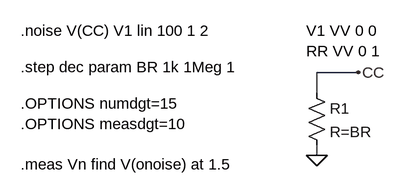
[diagram p0: schematic Fig_3-16_BR-noise.asc]
Fig_3-16_BR-noise.asc, the LTspice schematic file:
Version 4
SHEET 1 880 680
WIRE 368 112 304 112
WIRE 304 144 304 112
WIRE 304 240 304 224
FLAG 304 240 0
FLAG 368 112 CC
SYMBOL res 288 128 R0
SYMATTR InstName R1
SYMATTR Value R=BR
TEXT 288 48 Left 2 !V1 VV 0 0\nRR VV 0 1
TEXT -152 48 Left 2 !.noise V(CC) V1 lin 100 1 2
TEXT -152 104 Left 2 !.step dec param BR 1k 1Meg 1
TEXT -152 160 Left 2 !.OPTIONS numdgt=15\n.OPTIONS measdgt=10\n \n.meas Vn find V(onoise) at 1.5

The netlist it stands for:
* Fig_3-16_BR-noise.asc
R1 CC 0 R=BR
V1 VV 0 0
RR VV 0 1
.noise V(CC) V1 lin 100 1 2
.step dec param BR 1k 1Meg 1
.OPTIONS numdgt=15
.OPTIONS measdgt=10
.meas Vn find V(onoise) at 1.5
.backanno
.end